# Altium schematic sheet 01_COVER PAGE.SchDoc
size 420 x 297 mm; SheetNumber: 1; SheetTotal: 3
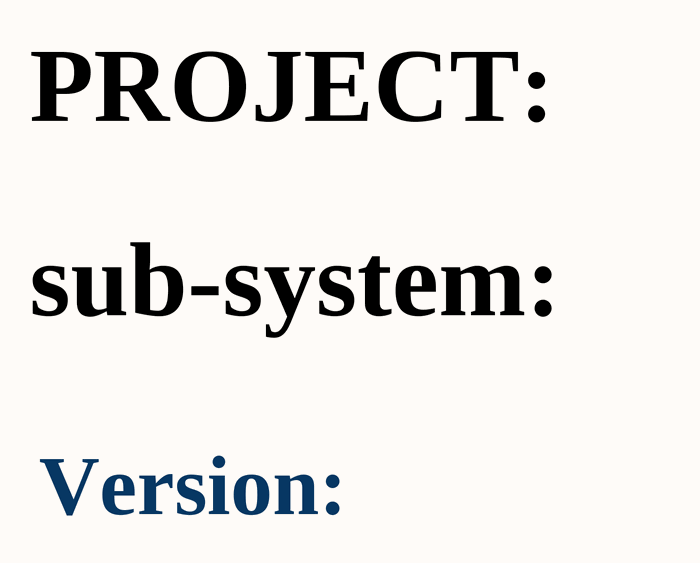
[diagram p0: 01_COVER PAGE.SchDoc]

## Notes on the sheet
- PROJECT:
- sub-system:
- Version:
- Project:
- Sub-system:
- Design by:
- Sheet title:
- Sheet
- of
- Checked by:
- Approved by:
- Revision:
- Document No:
- Size:
- Date:
- A3